# EAGLE schematic xenon-v1.00 (EAGLE 9.0.1)
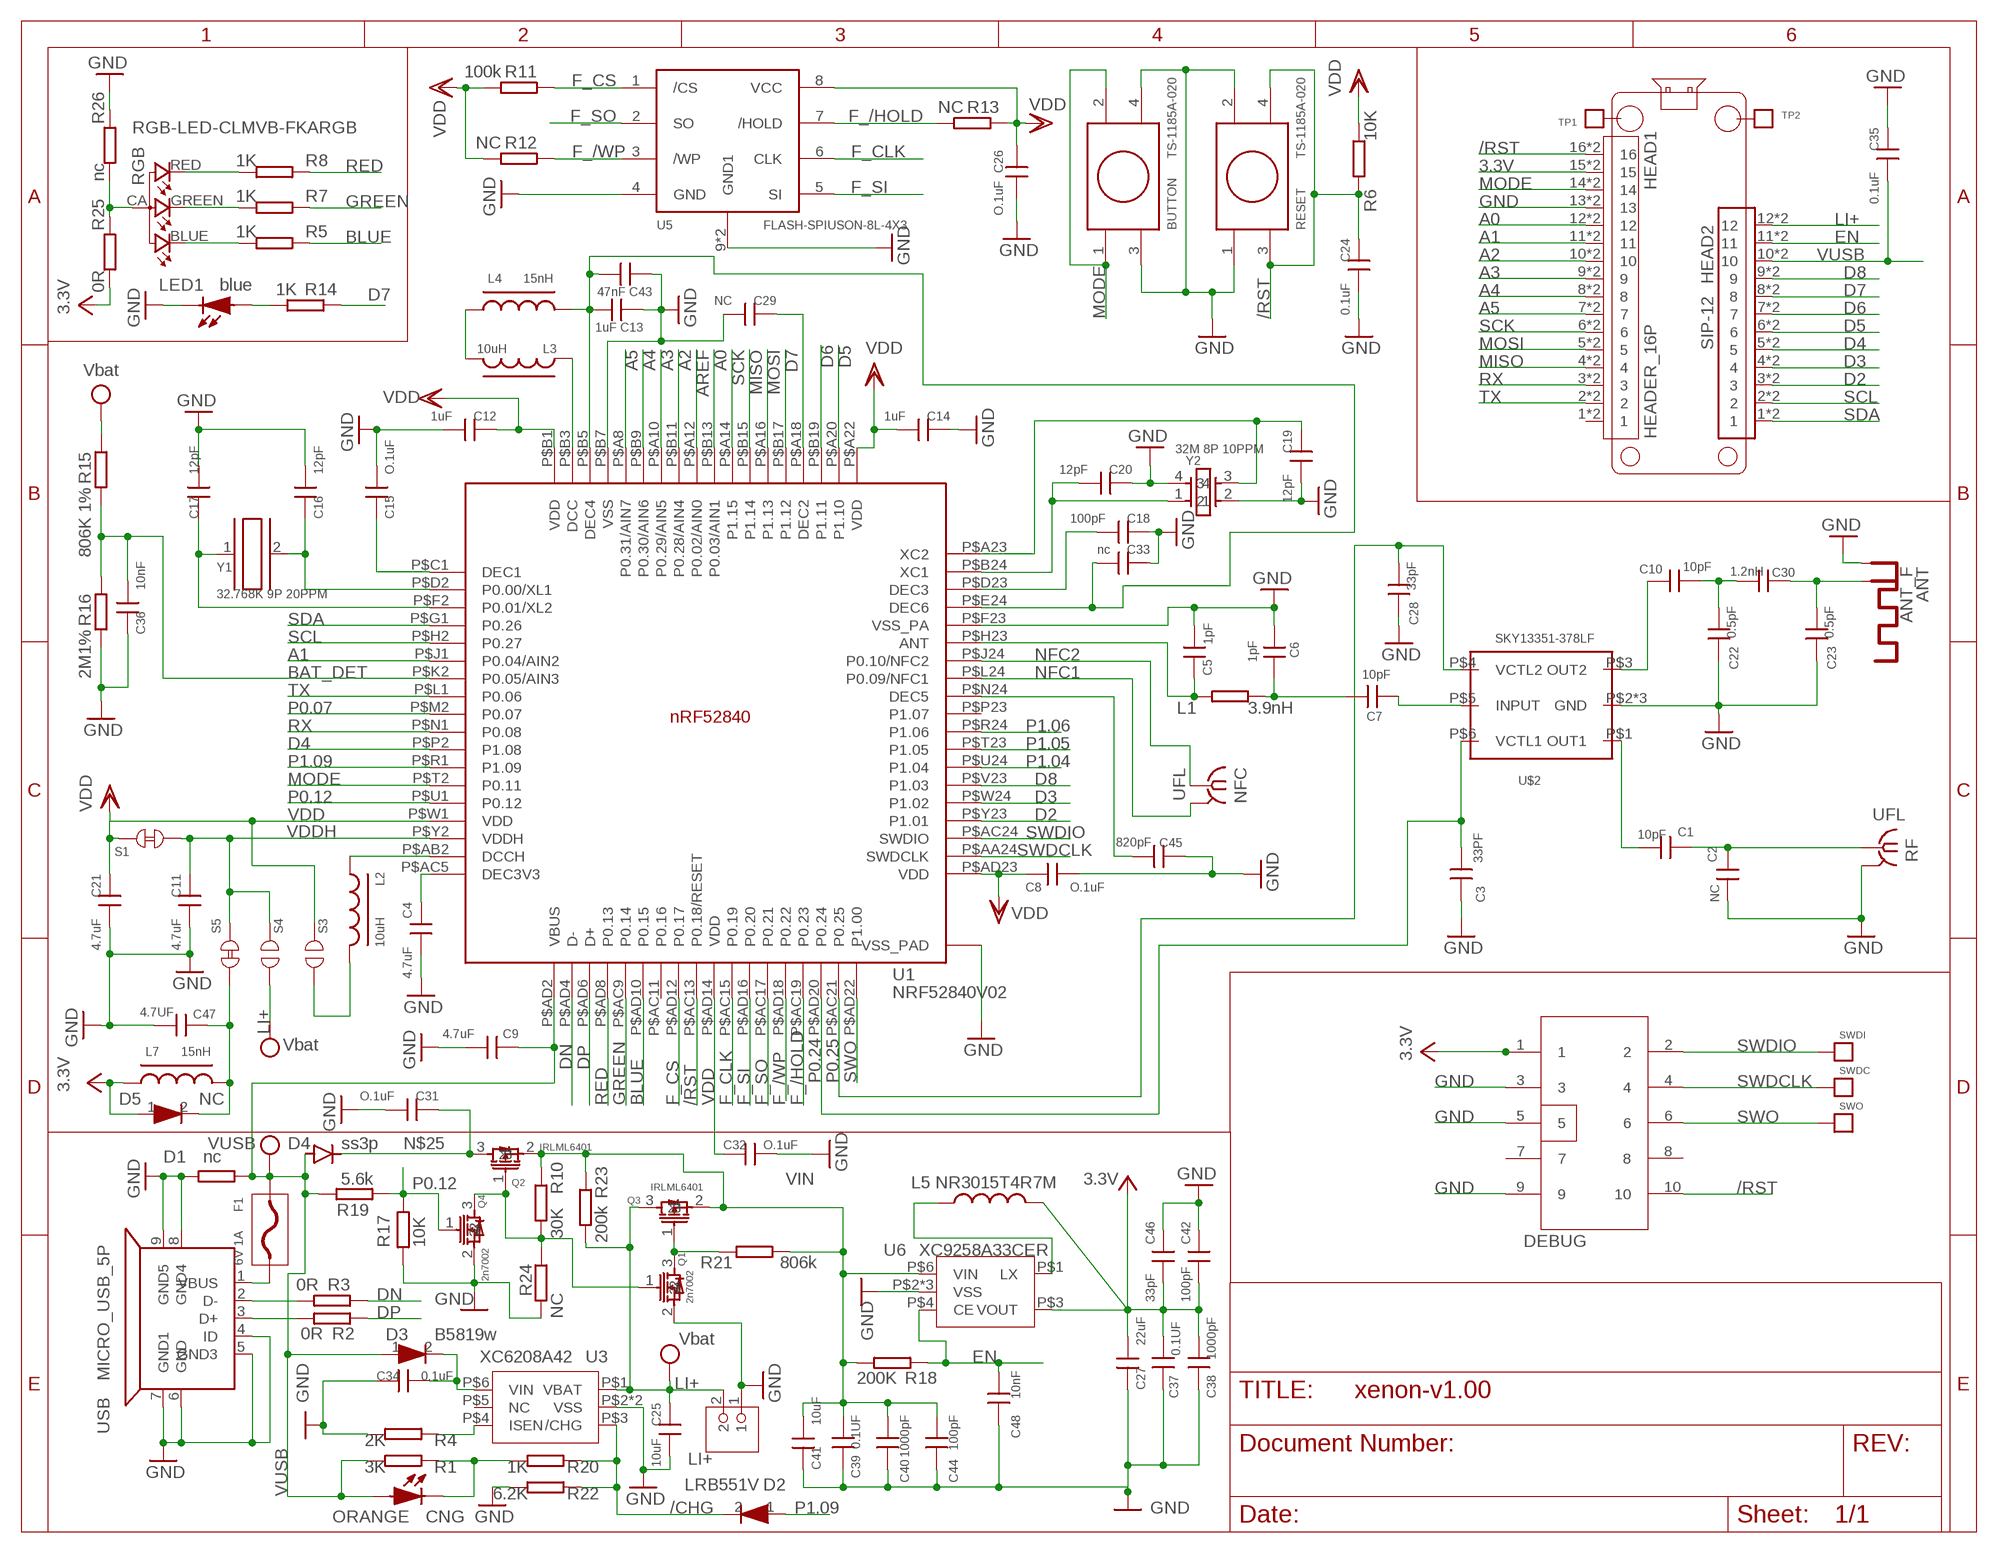
[diagram p0: schematic, sheet 1]

## Parts
ANT  ANT_F  ANTENNA_F_PCBANT2  [ANTENNA_F2_PCB]
BAT  CON2P_SMT  [CON_2.0MM_SMT]
BUTTON  TS-1185A-020  [TS-1185A-020]
C1  10pF  CAP0402  [C-0402]
C2  NC  CAP0402  [C-0402]
C3  33PF  CAP0402  [C-0402]
C4  4.7uF  CAP0402  [C-0402]
C5  1pF  CAP0402  [C-0402]
C6  1pF  CAP0402  [C-0402]
C7  10pF  CAP0402  [C-0402]
C8  O.1uF  CAP0402  [C-0402]
C9  4.7uF  CAP0402  [C-0402]
C10  10pF  CAP0402  [C-0402]
C11  4.7uF  CAP0402  [C-0402]
C12  1uF  CAP0402  [C-0402]
C13  1uF  CAP0402  [C-0402]
C14  1uF  CAP0402  [C-0402]
C15  O.1uF  CAP0402  [C-0402]
C16  12pF  CAP0402  [C-0402]
C17  12pF  CAP0402  [C-0402]
C18  100pF  CAP0402  [C-0402]
C19  12pF  CAP0402  [C-0402]
C20  12pF  CAP0402  [C-0402]
C21  4.7uF  CAP0402  [C-0402]
C22  0.5pF  CAP0402  [C-0402]
C23  0.5pF  CAP0402  [C-0402]
C24  0.1uF  CAP0402  [C-0402]
C25  10uF  CAPC0805  [C0805]
C26  O.1uF  CAP0402  [C-0402]
C27  22uF  CAPC0805  [C0805]
C28  33pF  CAP0402  [C-0402]
C29  NC  CAP0402  [C-0402]
C30  1.2nH  CAP0402  [C-0402]
C31  O.1uF  CAP0402  [C-0402]
C32  O.1uF  CAP0402  [C-0402]
C33  nc  CAP0402  [C-0402]
C34  0.1uF  CAP0402  [C-0402]
C35  0.1uF  CAP0402  [C-0402]
C36  10nF  CAP0402  [C-0402]
C37  0.1UF  CAP0402  [C-0402]
C38  1000pF  CAP0402  [C-0402]
C39  0.1UF  CAP0402  [C-0402]
C40  1000pF  CAP0402  [C-0402]
C41  10uF  CAPC0603  [C0603]
C42  100pF  CAP0402  [C-0402]
C43  47nF  CAP0402  [C-0402]
C44  100pF  CAP0402  [C-0402]
C45  820pF  CAP0402  [C-0402]
C46  33pF  CAP0402  [C-0402]
C47  4.7UF  CAP0402  [C-0402]
C48  10nF  CAP0402  [C-0402]
CNG  ORANGE  LED  [LED0603]
D1  nc  RES0402S  [R-0402S]
D2  LRB551V  DIODESOD323  [SOD-323]
D3  B5819w  DIODESOD123  [SOD-123]
D4  ss3p  DIODE  [DIODE-DO-220AA(SMP)]
D5  NC  DIODESOD323  [SOD-323]
DEBUG  CON5X2  [CON5X2_1.27]
F1  6V 1A  FUSE  [F0805]
HEAD1  HEADER_16P  [HEADER_16P2.54]
HEAD2  SIP-12  [SIP-12]
L1  3.9nH  RES0402S  [R-0402S]
L2  10uH  L  [R-0603A]
L3  10uH  L  [R-0603A]
L4  15nH  L0402  [R-0402S]
L5  NR3015T4R7M  INDUCTORB  [INDUCTOR-NR3015]
L7  15nH  L0402  [R-0402S]
LED1  blue  LED  [LED0603]
NFC  UFL  IPEX-20279-001E  [IPEX-20279-001E]
Q1  2n7002  NMOSSOT323  [SOT323]
Q2  IRLML6401  PMOS  [SOT-23]
Q3  IRLML6401  PMOS  [SOT-23]
Q4  2n7002  NMOSSOT323  [SOT323]
R1  3K  RES0402S  [R-0402S]
R2  0R  RES0402S  [R-0402S]
R3  0R  RES0402S  [R-0402S]
R4  2K  RES0402S  [R-0402S]
R5  1K  RES0402S  [R-0402S]
R6  10K  RES0402S  [R-0402S]
R7  1K  RES0402S  [R-0402S]
R8  1K  RES0402S  [R-0402S]
R10  30K  RES0402S  [R-0402S]
R11  100k  RES0402S  [R-0402S]
R12  NC  RES0402S  [R-0402S]
R13  NC  RES0402S  [R-0402S]
R14  1K  RES0402S  [R-0402S]
R15  806K 1%  RES0402S  [R-0402S]
R16  2M1%  RES0402S  [R-0402S]
R17  10K  RES0402S  [R-0402S]
R18  200K  RES0402S  [R-0402S]
R19  5.6k  RES0402S  [R-0402S]
R20  1K  RES0402S  [R-0402S]
R21  806k  RES0402S  [R-0402S]
R22  6.2K  RES0402S  [R-0402S]
R23  200k  RES0402S  [R-0402S]
R24  NC  RES0402S  [R-0402S]
R25  0R  RES0402S  [R-0402S]
R26  nc  RES0402S  [R-0402S]
RESET  TS-1185A-020  [TS-1185A-020]
RF  UFL  IPEX-20279-001E  [IPEX-20279-001E]
RGB  RGB-LED-CLMVB-FKARGB  [PLCC4-2MM-RGB]
S1  TP_SHORT  [TP_SHORT]
S3  TP_OPEN  [TP_OPEN]
S4  TP_OPEN  [TP_OPEN]
S5  TP_SHORT  [TP_SHORT]
SWDC  TPTP  [TP]
SWDI  TPTP  [TP]
SWO  TPTP  [TP]
TP1  TPTP2.5  [TP-2.5]
TP2  TPTP2.5  [TP-2.5]
U1  NRF52840V02  [AQN507X7X0.85_HA-74_V2]
U3  XC6208A42  [USP-6C]
U5  FLASH-SPIUSON-8L-4X3  [USON8-3X4]
U6  XC9258A33CER  XC9257/8USP-6  [USP-6C]
U$2  SKY13351-378LF  [MLPD-6-1X1]
USB  MICRO_USB_5P  MICRO_USBMICRO_USB  [MICRO_USB]
Y1  32.768K 9P 20PPM  CRY_32153215  [CRY_3215]
Y2  32M 8P 10PPM  CRY2520  [CRY_2520]

## Nets
3.3V: C27.1 C37.2 C38.2 C42.2 C46.2 D5.1 DEBUG.1 HEAD1.15 HEAD1.P$15 L5.2 L7.1 R25.2 U6.P$3(VOUT)
/CHG: D2.2 R20.1 R22.1 U3.P$3(/CHG)
/RST: C24.2 DEBUG.10 HEAD1.16 HEAD1.P$16 R6.1 RESET.3 RESET.4 U1.P$AC13(P0.18/RESET)
A0: HEAD1.12 HEAD1.P$12 U1.P$B13(P0.03/AIN1)
A1: HEAD1.11 HEAD1.P$11 U1.P$J1(P0.04/AIN2)
A2: HEAD1.10 HEAD1.P$10 U1.P$B11(P0.28/AIN4)
A3: HEAD1.9 HEAD1.P$9 U1.P$A10(P0.29/AIN5)
A4: HEAD1.8 HEAD1.P$8 U1.P$B9(P0.30/AIN6)
A5: HEAD1.7 HEAD1.P$7 U1.P$A8(P0.31/AIN7)
AREF: U1.P$A12(P0.02/AIN0)
BAT_DET: C36.1 R15.2 R16.1 U1.P$K2(P0.05/AIN3)
BLUE: R5.1 U1.P$AD10(P0.15)
D2: HEAD2.3 HEAD2.P$3 U1.P$Y23(P1.01)
D3: HEAD2.4 HEAD2.P$4 U1.P$W24(P1.02)
D4: HEAD2.5 HEAD2.P$5 U1.P$P2(P1.08)
D5: HEAD2.6 HEAD2.P$6 U1.P$A20(P1.10)
D6: HEAD2.7 HEAD2.P$7 U1.P$B19(P1.11)
D7: HEAD2.8 HEAD2.P$8 R14.1 U1.P$B17(P1.12)
D8: HEAD2.9 HEAD2.P$9 U1.P$V23(P1.03)
D+: R2.2 USB.3(D+)
D-: R3.2 USB.2(D-)
DN: R3.1 U1.P$AD4(D-)
DP: R2.1 U1.P$AD6(D+)
EN: C48.2 HEAD2.11 HEAD2.P$11 R18.1 U6.P$4(CE)
F_/HOLD: R13.2 U1.P$AC19(P0.23) U5.7(/HOLD)
F_/WP: R12.1 U1.P$AD18(P0.22) U5.3(/WP)
F_CLK: U1.P$AC15(P0.19) U5.6(CLK)
F_CS: R11.1 U1.P$AD12(P0.17) U5.1(/CS)
F_SI: U1.P$AD16(P0.20) U5.5(SI)
F_SO: U1.P$AC17(P0.21) U5.2(SO)
GND: ANT.GND BAT.1 BUTTON.3 BUTTON.4 C2.2 C3.1 C4.1 C5.1 C6.1 C8.1 C9.1 C11.1 C12.1 C13.2 C14.2 C15.1 C16.1 C17.1 C18.2 C19.1 C20.2 C21.1 C22.1 C23.1 C24.1 C25.1 C26.1 C27.2 C28.1 C29.1 C31.1 C32.1 C33.2 C34.2 C35.2 C36.2 C37.1 C38.1 C39.1 C40.1 C41.2 C42.1 C43.2 C44.1 C45.2 C46.1 C47.2 C48.1 D1.1 DEBUG.3 DEBUG.5 DEBUG.9 HEAD1.13 HEAD1.P$13 LED1.2(K) Q1.2 Q4.2 R4.2 R16.2 R17.1 R22.2 R24.1 R26.1 RESET.1 RESET.2 RF.2@1(GND) RF.2@2(GND) U1.P$74(VSS_PAD) U1.P$75(VSS_PAD) U1.P$76(VSS_PAD) U1.P$77(VSS_PAD) U1.P$78(VSS_PAD) U1.P$79(VSS_PAD) U1.P$80(VSS_PAD) U1.P$81(VSS_PAD) U1.P$82(VSS_PAD) U1.P$85(VSS_PAD) U1.P$B7(VSS) U1.P$F23(VSS_PA) U3.P$2(VSS) U3.P$7(VSS) U5.4(GND) U5.9(GND1) U5.10(GND1) U6.P$2(VSS) U6.P$5(VSS) U6.P$7(VSS) U$2.P$2(GND) U$2.P$7(GND) U$2.P$8(GND) USB.4(ID) USB.5(GND3) USB.6(GND) USB.7(GND1) USB.8(GND4) USB.9(GND5) Y2.2 Y2.4
GREEN: R7.1 U1.P$AC9(P0.14)
LI+: BAT.2 C25.2 HEAD2.12 HEAD2.P$12 Q3.3 R15.1 R23.1 S4.1 U3.P$1(VBAT) ; supply symbol labelled Vbat
MISO: HEAD1.4 HEAD1.P$4 U1.P$B15(P1.14)
MODE: BUTTON.1 BUTTON.2 HEAD1.14 HEAD1.P$14 U1.P$T2(P0.11)
MOSI: HEAD1.5 HEAD1.P$5 U1.P$A16(P1.13)
N$1: L2.1 U1.P$AB2(DCCH)
N$2: C5.2 L1.1 U1.P$H23(ANT)
N$3: C6.2 C7.2 L1.2
N$4: C16.2 U1.P$D2(P0.00/XL1) Y1.2
N$5: C13.1 C33.1 C43.1 L4.2 U1.P$B5(DEC4) U1.P$E24(DEC6)
N$6: L3.2 L4.1
N$7: L3.1 U1.P$B3(DCC)
N$8: C15.2 U1.P$C1(DEC1)
N$9: C17.2 U1.P$F2(P0.01/XL2) Y1.1
N$10: C1.1 C2.1 RF.1
N$11: C19.2 U1.P$A23(XC2) Y2.3
N$12: C18.1 U1.P$D23(DEC3)
N$13: LED1.1(A) R14.2
N$14: L2.2 S3.1
N$15: C20.1 U1.P$B24(XC1) Y2.1
N$16: C7.1 U$2.P$5(INPUT)
N$17: C10.1 U$2.P$3(OUT2)
N$18: F1.P$1 USB.1(VBUS)
N$20: C47.1 D5.2 L7.2 S5.2
N$21: CNG.2(K) R1.1 R20.2
N$22: R4.1 U3.P$4(ISEN)
N$23: R8.2 RGB.RED
N$24: R25.1 R26.2 RGB.CA
N$25: C31.2 D4.CATHODE Q2.3
N$26: R5.2 RGB.BLUE
N$27: R7.2 RGB.GREEN
N$28: C29.2 U1.P$A18(DEC2)
N$29: C4.2 U1.P$AC5(DEC3V3)
N$30: C45.1 U1.P$N24(DEC5)
N$31: C10.2 C22.2 C30.2
N$32: ANT.RF C23.2 C30.1
N$33: Q1.1 Q2.1 Q4.3 R10.1 R24.2
N$34: C1.2 U$2.P$1(OUT1)
N$35: C34.1 D3.2 U3.P$6(VIN)
N$36: Q1.3 Q3.1 R21.2
N$38: L5.1 U6.P$1(LX)
NFC1: NFC.2@1(GND) NFC.2@2(GND) U1.P$L24(P0.09/NFC1)
NFC2: NFC.1 U1.P$J24(P0.10/NFC2)
P0.07: U1.P$M2(P0.07)
P0.12: Q4.1 R17.2 R19.2 U1.P$U1(P0.12)
P0.24: C3.2 U1.P$AD20(P0.24) U$2.P$6(VCTL1)
P0.25: C28.2 U1.P$AC21(P0.25) U$2.P$4(VCTL2)
P1.04: U1.P$U24(P1.04)
P1.05: U1.P$T23(P1.05)
P1.06: U1.P$R24(P1.06)
P1.09: D2.1 U1.P$R1(P1.09)
RED: R8.1 U1.P$AD8(P0.13)
RX: HEAD1.3 HEAD1.P$3 U1.P$N1(P0.08)
SCK: HEAD1.6 HEAD1.P$6 U1.P$A14(P1.15)
SCL: HEAD2.2 HEAD2.P$2 U1.P$H2(P0.27)
SDA: HEAD2.1 HEAD2.P$1 U1.P$G1(P0.26)
SWDCLK: DEBUG.4 SWDC.P$1 U1.P$AA24(SWDCLK)
SWDIO: DEBUG.2 SWDI.P$1 U1.P$AC24(SWDIO)
SWO: DEBUG.6 SWO.P$1 U1.P$AD22(P1.00)
TX: HEAD1.2 HEAD1.P$2 U1.P$L1(P0.06)
VDD: C8.2 C12.2 C14.1 C21.2 C26.2 C32.2 R6.2 R11.2 R12.2 R13.1 S1.1 S3.2 U1.P$A22(VDD) U1.P$AD14(VDD) U1.P$AD23(VDD) U1.P$B1(VDD) U1.P$W1(VDD) U5.8(VCC)
VDDH: C11.2 S1.2 S4.2 S5.1 U1.P$Y2(VDDH)
VIN: C39.2 C40.2 C41.1 C44.2 Q2.2 Q3.2 R10.2 R18.2 R21.1 R23.2 U6.P$6(VIN)
VUSB: C9.2 C35.1 CNG.1(A) D1.2 D3.1 D4.ANODE F1.P$2 HEAD2.10 HEAD2.P$10 R1.2 R19.1 U1.P$AD2(VBUS)
Unconnected: DEBUG.7 DEBUG.8 HEAD1.1 HEAD1.P$1 TP1.1 TP2.1 U1.P$AC11(P0.16) U1.P$P23(P1.07) U3.P$5(NC)

## Library data of the parts
ANT = Particle:ANTENNA_F_PCB: F Style 2.4GHz PCB Trace Antenna
BAT = RedBear:CON2P_SMT
BUTTON RESET = RedBear DUO:TS-1185A-020
C1-C48 = RedBear:CAP: CAP
CNG LED1 = particle SZ:LED: LED
D1 L1 R1-R8 R10-R26 = RedBear:RES: RES
D2 D3 D5 = particle SZ:DIODE: DIODE
D4 = Particle:DIODE
DEBUG = RedBear:CON5X2
F1 = RedBear:FUSE
HEAD1 = particle SZ:HEADER_16P
HEAD2 = particle SZ:SIP-12
L2-L4 L7 = RedBear:L
L5 = Spark:INDUCTOR
NFC RF = Particle:IPEX-20279-001E: Ultra Miniature Coaxial SMT RF Receptacle
Q1 = RedBear:NMOS: NMOS
Q2 Q3 = RedBear:PMOS: PMOS
Q4 = particle SZ:NMOS: NMOS
RGB = Particle:RGB-LED-CLMVB-FKA: CREE CLMVB-FKA RGB LED 2mm x 2mm
S1 S5 = particle SZ:TP_SHORT
S3 S4 = particle SZ:TP_OPEN
SWDC SWDI SWO TP1 TP2 = RedBear:TP
U1 = particle SZ:NRF52840
U3 = particle SZ:XC6208A42
U5 = particle SZ:FLASH-SPI
U6 = particle SZ:XC9257/8
U$2 = particle SZ:SKY13351-378LF
USB = RedBear:MICRO_USB: Micro-USB
Y1 = RedBear:CRY_3215
Y2 = RedBear DUO:CRY